# Altium schematic sheet DEVICE.SchDoc
size A3
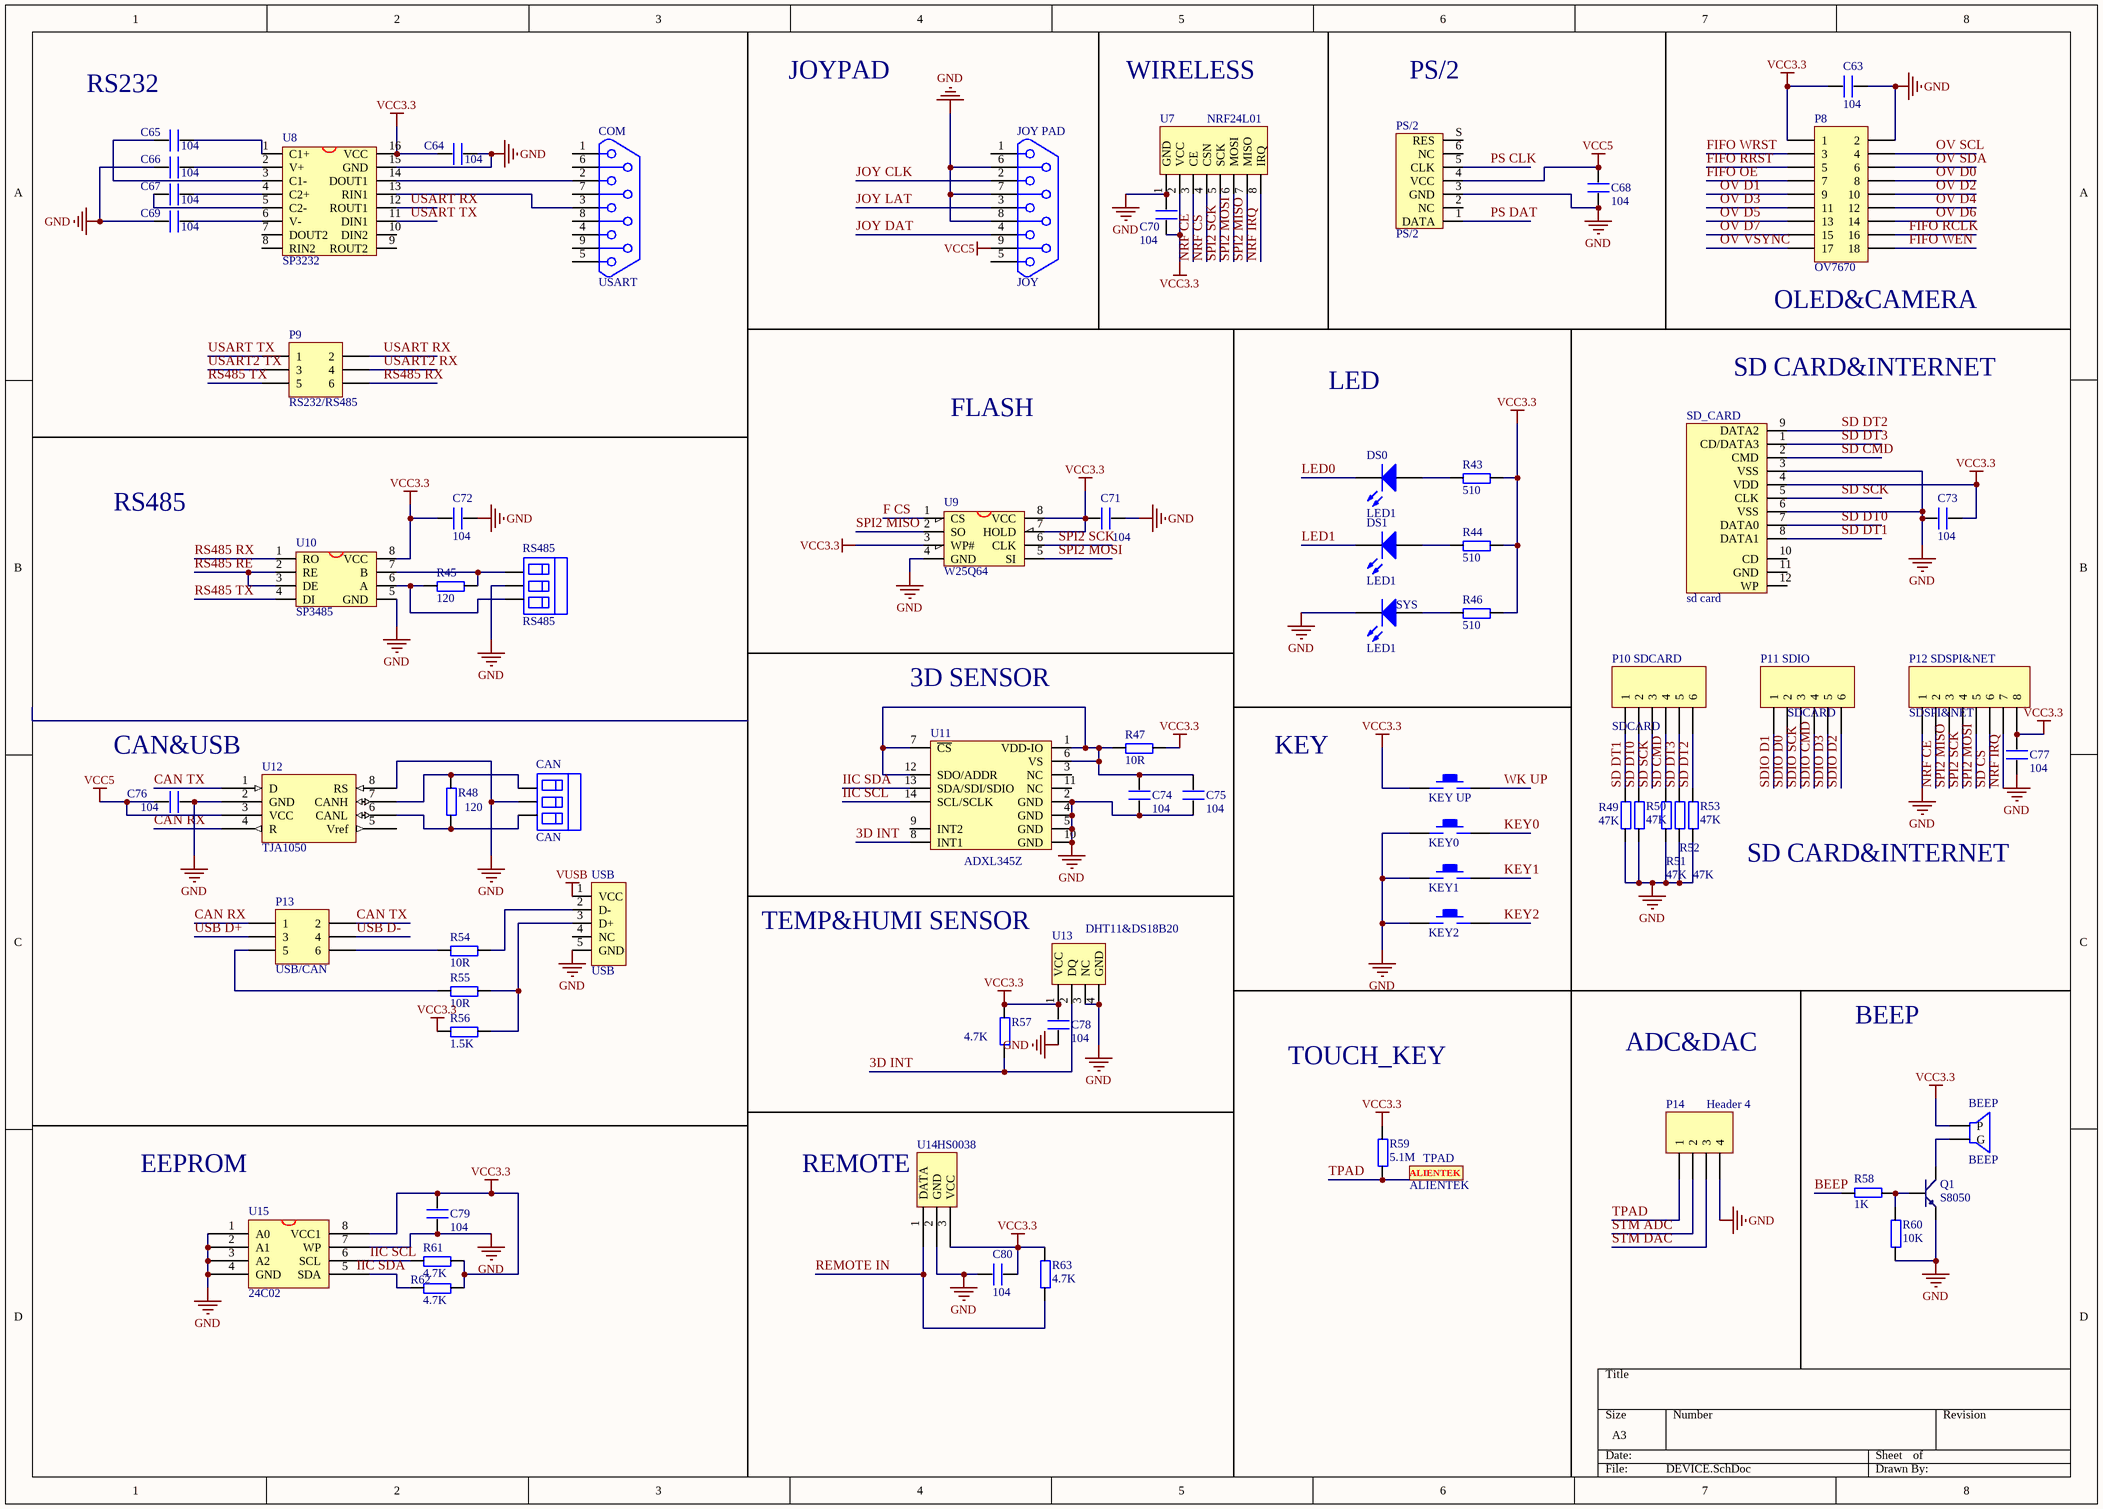
[diagram p0: DEVICE.SchDoc]

## Parts
BEEP  BEEP  [BELL-5]
C63  104  [0603P]
C64  104  [0603P]
C65  104  [0603P]
C66  104  [0603P]
C67  104  [0603P]
C68  104  [0603P]
C69  104  [0603P]
C70  104  [0603P]
C71  104  [0603P]
C72  104  [0603P]
C73  104  [0603P]
C74  104  [0603P]
C75  104  [0603P]
C76  104  [0603P]
C77  104  [0603P]
C78  104  [0603P]
C79  104  [0603P]
C80  104  [0603P]
CAN  CAN  [MKDSN_3RMI]
COM  USART  [DB9]
DS0  LED1  [SMDLED]
DS1  LED1  [SMDLED]
JOY_PAD  JOY  [DB9]
KEY0  KEY_M  [KEY_M]  (value not drawn)
KEY1  KEY_M  [KEY_M]  (value not drawn)
KEY2  KEY_M  [KEY_M]  (value not drawn)
KEY_UP  KEY_M  [KEY_M]  (value not drawn)
P8  OV7670  [HDR2X9]
P9  RS232/RS485  [HDR2X3]
P10_SDCARD  SDCARD  [HDR1X6]
P11_SDIO  SDCARD  [HDR1X6]
P12_SDSPI&NET  SDSPI&NET  [HDR1X8]
P13  USB/CAN  [HDR2X3]
P14  Header 4  [HDR1X4]
PS/2  PS/2  [PS2-6PIN]
Q1  S8050  [SOT-23R]
R43  510  [0603P]
R44  510  [0603P]
R45  120  [0603P]
R46  510  [0603P]
R47  10R  [0603P]
R48  120  [0603P]
R49  47K  [0603P]
R50  47K  [0603P]
R51  47K  [0603P]
R52  47K  [0603P]
R53  47K  [0603P]
R54  10R  [0603P]
R55  10R  [0603P]
R56  1.5K  [0603P]
R57  4.7K  [0603P]
R58  1K  [0603P]
R59  5.1M  [0603P]
R60  10K  [0603P]
R61  4.7K  [0603P]
R62  4.7K  [0603P]
R63  4.7K  [0603P]
RS485  RS485  [MKDSN_3RMI]
SD_CARD  sd card  [SDCARD_L]
SYS  LED1  [SMDLED]
TPAD  ALIENTEK  [ALIENTEK_PAD]
U7  NRF24L01  [NRF24L01]
U8  SP3232  [SOP16M]
U9  W25Q64  [SOIC-8]
U10  SP3485  [SOP-8]
U11  ADXL345Z  [LGA14]
U12  TJA1050  [SOP-8]
U13  DHT11&DS18B20  [DHT11]
U14  HS0038  [HS0038]
U15  24C02  [SOP-8]
USB  USB  [USB/SM0.8-6H5]

## Nets
GND: C63.2 C64.2 C66.1 C68.1 C69.1 C70.2 C71.2 C72.2 C73.1 C74.1 C75.1 C76.2 C77.1 C78.1 C79.1 C80.1 CAN.2 JOY_PAD.6 JOY_PAD.7 JOY_PAD.8 KEY0.1 KEY1.1 KEY2.1 P8.2 P12_SDSPI&NET.1 P14.4 PS/2.3(GND) Q1.1(E) R49.1 R50.1 R51.1 R52.1 R53.1 R60.1 RS485.2 SD_CARD.3(VSS) SD_CARD.6(VSS) SYS.2(K) U7.1(GND) U8.15(GND) U9.4(GND) U10.5(GND) U11.2(GND) U11.4(GND) U11.5(GND) U11.10(GND) U12.2(GND) U12.8(RS) U13.3(NC) U13.4(GND) U14.2(GND) U15.1(A0) U15.2(A1) U15.3(A2) U15.4(GND) U15.7(WP) USB.5(GND)
VCC3.3: BEEP.1(P) C63.1 C64.1 C70.1 C71.1 C72.1 C73.2 C77.2 C78.2 C79.2 C80.2 KEY_UP.1 P8.1 P12_SDSPI&NET.8 R43.2 R44.2 R46.2 R47.2 R56.1 R57.2 R59.2 R61.2 R62.2 R63.2 SD_CARD.4(VDD) U7.2(VCC) U8.16(VCC) U9.3(WP#) U9.7(HOLD) U9.8(VCC) U10.8(VCC) U13.1(VCC) U14.3(VCC) U15.8(VCC1)
VCC5: C68.2 C76.1 JOY_PAD.9 PS/2.4(VCC) U12.3(VCC)
VUSB: USB.1(VCC)
3D INT: R57.1 U11.8(INT1) U13.2(DQ)
BEEP: R58.2
CAN RX: P13.1 U12.4(R)
CAN TX: P13.2 U12.1(D)
F CS: U9.1(CS)
FIFO OE: P8.7
FIFO RCLK: P8.16
FIFO RRST: P8.5
FIFO WEN: P8.18
FIFO WRST: P8.3
IIC SCL: R61.1 U11.14(SCL/SCLK) U15.6(SCL)
IIC SDA: U11.13(SDA/SDI/SDIO)
JOY CLK: JOY_PAD.2
JOY DAT: JOY_PAD.4
JOY LAT: JOY_PAD.3
KEY0: KEY0.2
KEY1: KEY1.2
KEY2: KEY2.2
LED0: DS0.2(K)
LED1: DS1.2(K)
NRF CE: P12_SDSPI&NET.2 U7.3(CE)
NRF CS: U7.4(CSN)
NRF IRQ: P12_SDSPI&NET.7 U7.8(IRQ)
OV D0: P8.8
OV D1: P8.9
OV D2: P8.10
OV D3: P8.11
OV D4: P8.12
OV D5: P8.13
OV D6: P8.14
OV D7: P8.15
OV SCL: P8.4
OV SDA: P8.6
OV VSYNC: P8.17
PS CLK: PS/2.5(CLK)
PS DAT: PS/2.1(DATA)
REMOTE IN: R63.1 U14.1(DATA)
RS485 RE: U10.2(RE) U10.3(DE)
RS485 RX: P9.6 U10.1(RO)
RS485 TX: P9.5 U10.4(DI)
SD CMD: P10_SDCARD.4 R51.2 SD_CARD.2(CMD)
SD CS: P12_SDSPI&NET.6
SD DT0: P10_SDCARD.2 R50.2 SD_CARD.7(DATA0)
SD DT1: P10_SDCARD.1 R49.2 SD_CARD.8(DATA1)
SD DT2: P10_SDCARD.6 R53.2 SD_CARD.9(DATA2)
SD DT3: P10_SDCARD.5 R52.2 SD_CARD.1(CD/DATA3)
SD SCK: P10_SDCARD.3 SD_CARD.5(CLK)
SDIO CMD: P11_SDIO.4
SDIO D0: P11_SDIO.2
SDIO D1: P11_SDIO.1
SDIO D2: P11_SDIO.6
SDIO D3: P11_SDIO.5
SDIO SCK: P11_SDIO.3
SPI2 MISO: P12_SDSPI&NET.3 U7.7(MISO) U9.2(SO)
SPI2 MOSI: P12_SDSPI&NET.5 U7.6(MOSI) U9.5(SI)
SPI2 SCK: P12_SDSPI&NET.4 U7.5(SCK) U9.6(CLK)
STM ADC: P14.2
STM DAC: P14.3
TPAD: P14.1 R59.1
USART2 RX: P9.4
USART2 TX: P9.3
USART RX: P9.2 U8.12(ROUT1)
USART TX: P9.1 U8.11(DIN1)
USB D+: P13.3
USB D-: P13.4
WK UP: KEY_UP.2
NetBEEP_2: BEEP.2(G) Q1.3(C)
NetC65_1: C65.1 U8.3(C1-)
NetC65_2: C65.2 U8.1(C1+)
NetC66_2: C66.2 U8.2(V+)
NetC67_1: C67.1 U8.5(C2-)
NetC67_2: C67.2 U8.4(C2+)
NetC69_2: C69.2 U8.6(V-)
NetC74_2: C74.2 C75.2 R47.1 U11.1(VDD-IO) U11.6(VS) U11.7(~{CS}) U11.12(SDO/ADDR)
NetCAN_1: CAN.1 R48.2 U12.7(CANH)
NetCAN_3: CAN.3 R48.1 U12.6(CANL)
NetCOM_2: COM.2 U8.14(DOUT1)
NetCOM_3: COM.3 U8.13(RIN1)
NetDS0_1: DS0.1(A) R43.1
NetDS1_1: DS1.1(A) R44.1
NetP13_5: P13.5 R55.1
NetP13_6: P13.6 R54.1
NetQ1_2: Q1.2(B) R58.1 R60.2
NetR45_1: R45.1 RS485.3 U10.6(A)
NetR45_2: R45.2 RS485.1 U10.7(B)
NetR46_1: R46.1 SYS.1(A)
NetR54_2: R54.2 USB.2(D-)
NetR55_2: R55.2 R56.2 USB.3(D+)
NetR62_1: R62.1 U15.5(SDA)

Not connected (* = marked no-connect by the designer): COM 1 4 5 6 7 8 9; JOY_PAD 1 5; PS/2 2(NC) 6(NC) S(RES); SD_CARD 10(CD) 11(GND) 12(WP); U8 7(DOUT2) 8(RIN2) 9(ROUT2) 10(DIN2); U11 3(NC) 9(INT2) 11(NC); U12 5(Vref); USB 4(NC)

## Notes on the sheet
- (near C65) RS232
- JOYPAD
- WIRELESS
- PS/2
- (near P8) OLED&CAMERA
- (near SD_CARD) SD CARD&INTERNET
- FLASH
- LED
- RS485
- 3D SENSOR
- CAN&USB
- KEY
- SD CARD&INTERNET
- TEMP&HUMI SENSOR
- ADC&DAC
- BEEP
- TOUCH_KEY
- EEPROM
- (near U14) REMOTE
- Labels drawn without touching a wire or pin: IIC SDA

## Library data of the parts
C63-C80 = C
CAN RS485 = HEAD3
COM JOY_PAD = DB9
DS0 DS1 SYS = LED2: Typical RED, GREEN, YELLOW, AMBER GaAs LED; Published: 8-Jun-2000; LatestRevisionDate: 17-Jul-2002; LatestRevisionNote: Re-released for DXP Platform.; PackageDocument: Feb-2002; PackageReference: 3.2X1.6X1.1; Publisher: Altium Limited
P8 = Header 9X2: Header, 9-Pin, Dual row; LatestRevisionDate: 17-Jul-2002; LatestRevisionNote: Re-released for DXP Platform.; Publisher: Altium Limited
P9 P13 = Header 3X2: Header, 3-Pin, Dual row; LatestRevisionDate: 17-Jul-2002; LatestRevisionNote: Re-released for DXP Platform.; Publisher: Altium Limited
P10_SDCARD P11_SDIO = Header 6: Header, 6-Pin; LatestRevisionDate: 17-Jul-2002; LatestRevisionNote: Re-released for DXP Platform.; Publisher: Altium Limited
P12_SDSPI&NET = Header 8: Header, 8-Pin; LatestRevisionDate: 17-Jul-2002; LatestRevisionNote: Re-released for DXP Platform.; Publisher: Altium Limited
P14 = Header 4: Header, 4-Pin; LatestRevisionDate: 17-Jul-2002; LatestRevisionNote: Re-released for DXP Platform.; Publisher: Altium Limited
PS/2 = P/S2
Q1 = NPN: 8050/BCW846/BCW847
R43-R63 = R
U8 = MAX3232
U9 = W25X16: W25X16;SST25VF016;MX25L1605
U10 = MAX3485
U12 = SN65HVD230D
U13 = DHT11: 数字温湿度传感器
U15 = 24C256
USB = USB5